# Altium schematic sheet FINGER_USB_HUB.SchDoc
size Letter; SheetNumber: 15; SheetTotal: 15
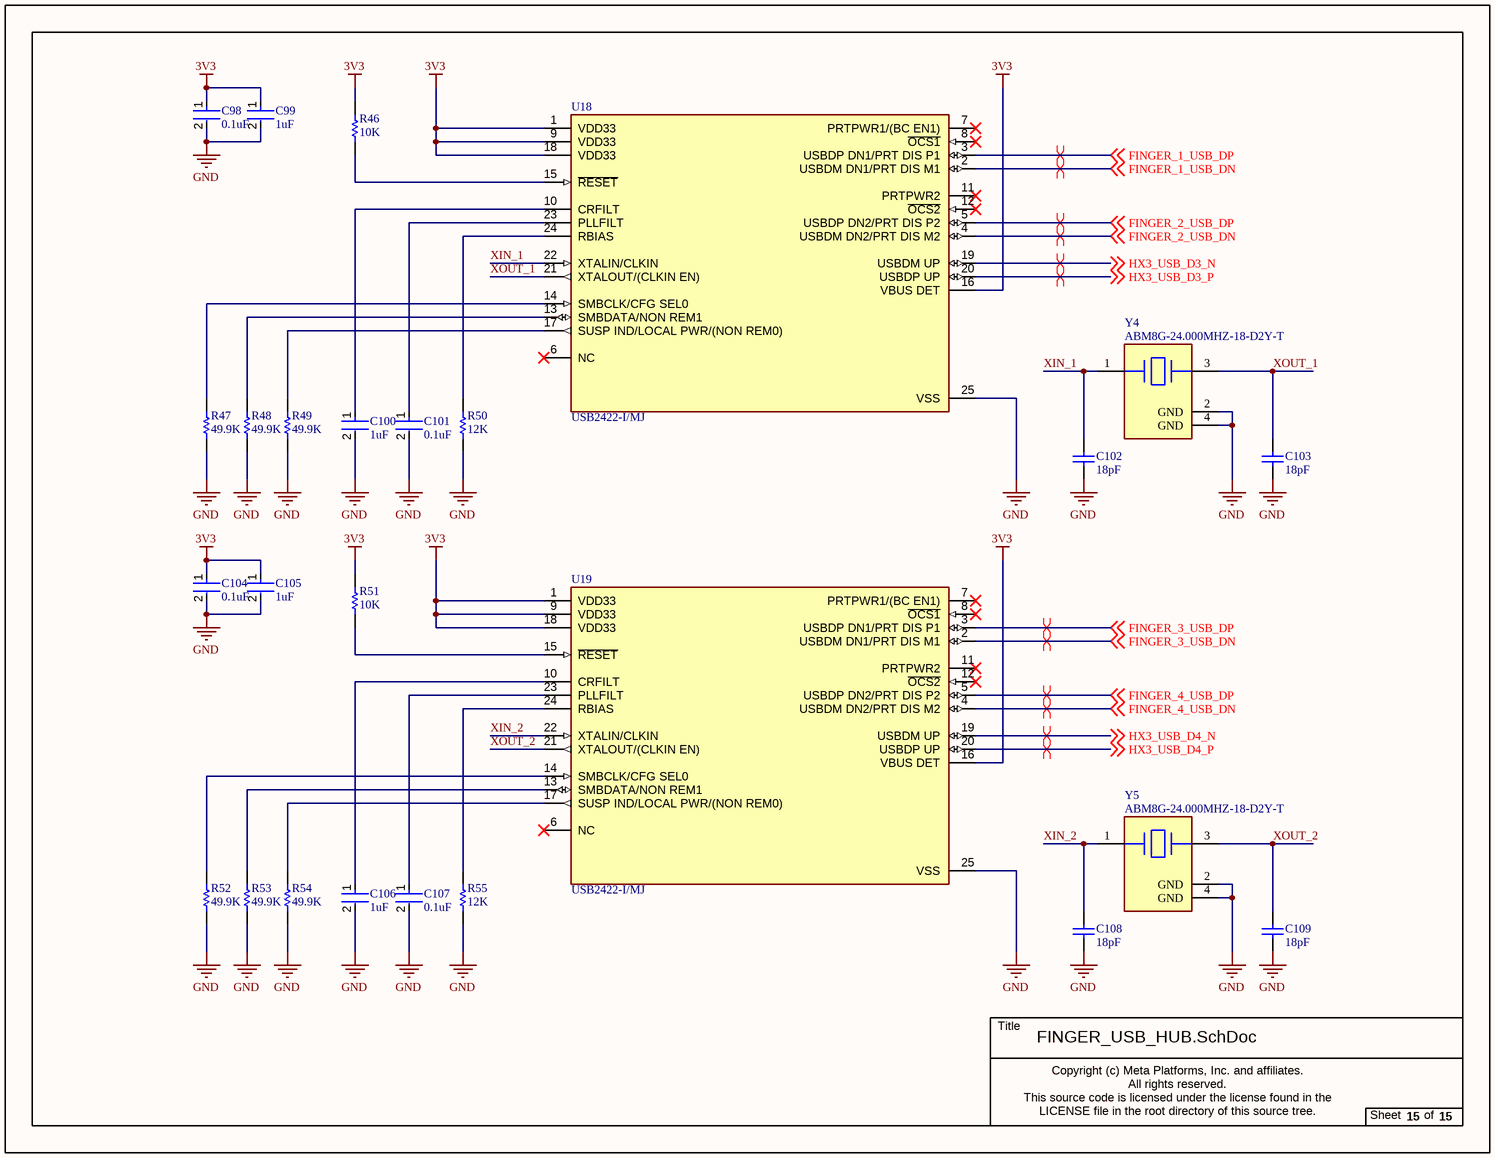
[diagram p0: FINGER_USB_HUB.SchDoc]

## Parts
C98  0.1uF  [FP-CC0201-BA-MFG]
C99  1uF  [FP-CL511-IPC_C]
C100  1uF  [FP-CL511-IPC_C]
C101  0.1uF  [FP-CC0201-BA-MFG]
C102  18pF  [CAPC1005X55X25NL05T10]
C103  18pF  [CAPC1005X55X25NL05T10]
C104  0.1uF  [FP-CC0201-BA-MFG]
C105  1uF  [FP-CL511-IPC_C]
C106  1uF  [FP-CL511-IPC_C]
C107  0.1uF  [FP-CC0201-BA-MFG]
C108  18pF  [CAPC1005X55X25NL05T10]
C109  18pF  [CAPC1005X55X25NL05T10]
R46  10K  [RESC1005X40X25ML05T10]
R47  49.9K  [RESC1005X40X25ML05T10]
R48  49.9K  [RESC1005X40X25ML05T10]
R49  49.9K  [RESC1005X40X25ML05T10]
R50  12K  [RESC1005X40X25ML05T05]
R51  10K  [RESC1005X40X25ML05T10]
R52  49.9K  [RESC1005X40X25ML05T10]
R53  49.9K  [RESC1005X40X25ML05T10]
R54  49.9K  [RESC1005X40X25ML05T10]
R55  12K  [RESC1005X40X25ML05T05]
U18  USB2422-I/MJ  [FP-24-S4QFN-4x4B-0_5P-MFG]
U19  USB2422-I/MJ  [FP-24-S4QFN-4x4B-0_5P-MFG]
Y4  ABM8G-24.000MHZ-18-D2Y-T  [FP-ABM8G-MFG]
Y5  ABM8G-24.000MHZ-18-D2Y-T  [FP-ABM8G-MFG]

## Nets
3V3: C98.1 C99.1 C104.1 C105.1 R46.2 R51.2 U18.1(VDD33) U18.9(VDD33) U18.16(VBUS_DET) U18.18(VDD33) U19.1(VDD33) U19.9(VDD33) U19.16(VBUS_DET) U19.18(VDD33)
GND: C98.2 C99.2 C100.2 C101.2 C102.1 C103.1 C104.2 C105.2 C106.2 C107.2 C108.1 C109.1 R47.1 R48.1 R49.1 R50.1 R52.1 R53.1 R54.1 R55.1 U18.25(VSS) U19.25(VSS) Y4.2(GND) Y4.4(GND) Y5.2(GND) Y5.4(GND)
FINGER_1_USB_DN: U18.2(USBDM_DN1/PRT_DIS_M1) ; off-sheet FINGER_1_USB_DN
FINGER_1_USB_DP: U18.3(USBDP_DN1/PRT_DIS_P1) ; off-sheet FINGER_1_USB_DP
FINGER_2_USB_DN: U18.4(USBDM_DN2/PRT_DIS_M2) ; off-sheet FINGER_2_USB_DN
FINGER_2_USB_DP: U18.5(USBDP_DN2/PRT_DIS_P2) ; off-sheet FINGER_2_USB_DP
FINGER_3_USB_DN: U19.2(USBDM_DN1/PRT_DIS_M1) ; off-sheet FINGER_3_USB_DN
FINGER_3_USB_DP: U19.3(USBDP_DN1/PRT_DIS_P1) ; off-sheet FINGER_3_USB_DP
FINGER_4_USB_DN: U19.4(USBDM_DN2/PRT_DIS_M2) ; off-sheet FINGER_4_USB_DN
FINGER_4_USB_DP: U19.5(USBDP_DN2/PRT_DIS_P2) ; off-sheet FINGER_4_USB_DP
HX3_USB_D3_N: U18.19(USBDM_UP) ; off-sheet HX3_USB_D3_N
HX3_USB_D3_P: U18.20(USBDP_UP) ; off-sheet HX3_USB_D3_P
HX3_USB_D4_N: U19.19(USBDM_UP) ; off-sheet HX3_USB_D4_N
HX3_USB_D4_P: U19.20(USBDP_UP) ; off-sheet HX3_USB_D4_P
XIN_1: C102.2 U18.22(XTALIN/CLKIN) Y4.1
XIN_2: C108.2 U19.22(XTALIN/CLKIN) Y5.1
XOUT_1: C103.2 U18.21(XTALOUT/(CLKIN_EN)) Y4.3
XOUT_2: C109.2 U19.21(XTALOUT/(CLKIN_EN)) Y5.3
NetC100_1: C100.1 U18.10(CRFILT)
NetC101_1: C101.1 U18.23(PLLFILT)
NetC106_1: C106.1 U19.10(CRFILT)
NetC107_1: C107.1 U19.23(PLLFILT)
NetR46_1: R46.1 U18.15(~{RESET})
NetR47_2: R47.2 U18.14(SMBCLK/CFG_SEL0)
NetR48_2: R48.2 U18.13(SMBDATA/NON_REM1)
NetR49_2: R49.2 U18.17(SUSP_IND/LOCAL_PWR/(NON_REM0))
NetR50_2: R50.2 U18.24(RBIAS)
NetR51_1: R51.1 U19.15(~{RESET})
NetR52_2: R52.2 U19.14(SMBCLK/CFG_SEL0)
NetR53_2: R53.2 U19.13(SMBDATA/NON_REM1)
NetR54_2: R54.2 U19.17(SUSP_IND/LOCAL_PWR/(NON_REM0))
NetR55_2: R55.2 U19.24(RBIAS)

Not connected (* = marked no-connect by the designer): U18 6(NC)* 7(PRTPWR1/(BC_EN1))* 8(~{OCS1})* 11(PRTPWR2)* 12(~{OCS2})*; U19 6(NC)* 7(PRTPWR1/(BC_EN1))* 8(~{OCS1})* 11(PRTPWR2)* 12(~{OCS2})*

## Layout directives
differential pair; differential pair class USB_2: FINGER_1_USB_DN, FINGER_1_USB_DP, FINGER_2_USB_DN, FINGER_2_USB_DP, FINGER_3_USB_DN, FINGER_3_USB_DP, FINGER_4_USB_DN, FINGER_4_USB_DP, HX3_USB_D3_N, HX3_USB_D3_P, HX3_USB_D4_N, HX3_USB_D4_P

## Notes on the sheet
- Title
- Copyright (c) Meta Platforms, Inc. and affiliates.
  All rights reserved.
  This source code is licensed under the license found in the
  LICENSE file in the root directory of this source tree.
- Sheet
- of

## Library data of the parts
C98 C101 C104 C107 = CMP-03422-000376-1: CAP CER 0.1UF 6.3V X5R 0201; Manufacturer: Yageo; Manufacturer Part Number: CC0201KRX5R5BB104; Tolerance: 0.1; Temperature Coefficient: 15%; Value: 100 nF; Material: Ceramic; Automotive: No; Device Class L2: Capacitors; Temperature Range High: +85°C; Capacitance: 100 nF; Temperature: -55°C to +85°C; ComponentLink2URL: http://www.yageo.com/documents/recent/UPY-GPHC_X5R_4V-to-50V_25.pdf; Category: Cap; Mouser Description: Multilayer Ceramic Capacitors MLCC - SMD/SMT 100nF 6.3V X5R 10%; Ipc Land Pattern Name: CAPC6030X30; Temperature Characteristic: X5R; Voltage Rating: 6.3 V; Lead Free: Yes; Digikey Description: CAP CER 0.1UF 6.3V X5R 0201; Device Class L1: Passive Components; Octopart: https://octopart.com/cc0201krx5r5bb104-yageo-9292636; Height: 0.33mm; Package: CC0201-BA; Footprint Url: http://www.yageo.com/exep/pages/download/literatures/UPY-C_GEN_24.pdf; ComponentLink2Description: Datasheet; Device Class L3: Ceramic Capacitors; Temperature Range Low: -55°C; RoHS: TRUE
C99 C100 C105 C106 = CMP-13271-001936-1: Cap Ceramic 1uF 10V X5R ±10% SMD 0402 +85°C Paper T/R; Depth: 0.5mm; Case Code (Imperial): 0402; Material: Ceramic; Mount: Surface Mount; Thickness: 0.022inch; Dielectric: X5R; Capacitance: 1uF; Radiation Hardening: No; Case/Package: 0402; Length: 1mm; Tolerance: 10%; Max Operating Temperature: 85°C; Package Quantity: 1; Width: 0.02inch; Voltage Rating: 10V; Contact Plating: Tin; Height: 0.5mm; Min Operating Temperature: -55°C; Case Code (Metric): 1005; Packaging: Tape and Reel
C102 C103 C108 C109 = CMP-2008-03918-1: Part Number: GRM1555C1H180JA01D; Manufacturer: Murata
R46 R51 = CMP-2002-03043-1: Part Number: CRCW040210K0FKEDHP; Manufacturer: Vishay Dale
R47-R49 R52-R54 = CMP-2002-07047-1: Manufacturer: Yageo / Phycomp; Part Number: RC0402FR-0749K9L
R50 R55 = CMP-2002-00646-4: Chip Resistor, 12 KOhm, +/- 1%, 0.1 W, -55 to 155 degC, 0402 (1005 Metric), RoHS, Tape and Reel; PartNumber: ERJ-2RKF1202X; Resistance: 12 KOhm; Voltage Rating: 50 V; Case\/Package: 0402; Power Rating: 100 mW; Length: 1 mm; PackageReference: 0402; DatasheetVersion: 04/2015; ComponentLink2Description: Datasheet; ComponentLink1URL: http://www.panasonic.com/; Pins: 2; Width: 0.5 mm; REACH SVHC: Yes; Packaging: Tape and Reel; Min Operating Temperature: -55 degC; Mounting Technology: Surface Mount; Max Operating Temperature: 155 degC; Case Code (Imperial): 0402; Height: 0.35 mm; Tolerance: 1%; PackageDescription: 2-Pin Surface Mount Device, Body 1 x 0.5 mm; RoHSCompliant: true; ComponentLink1Description: Manufacturer URL; Mount: Surface Mount; ComponentLink2URL: http://industrial.panasonic.com/cdbs/www-data/pdf/RDA0000/AOA0000C86.pdf; Package Quantity: 10000; Case Code (Metric): 1005
U18 U19 = CMP-06284-000010-1: IC HUB CTLR USB 2.0 24QFN; Manufacturer: Microchip; Min Supply Voltage: 3V; Standoff Height: 0mm; Usb Standard: USB 2.0; Interface: I2C,USB,SMBus; Number Of Ports: 2; Max Supply Voltage: 3.6V; Nominal Supply Current: 29-70mA; Device Class L1: Integrated Circuits (ICs); ComponentLink2URL: http://ww1.microchip.com/downloads/en/DeviceDoc/00001726B.pdf; Temperature: -40°C to +85°C; Lead Free: Yes; Category: IC; RoHS: TRUE; Digikey Description: IC HUB CTLR USB 2.0 24QFN; Device Class L2: Interface ICs; Height: 1mm; Device Class L3: USB Interface ICs; Temperature Range High: +85°C; Automotive: No; Ipc Land Pattern Name: QFN50P400X400X90-24; Temperature Range Low: -40°C; Manufacturer Part Number: USB2422-I/MJ; Mouser Description: Microchip USB2422-I/MJ; USB Controller; USB 2.0; 3 - 3.6 V; 24-Pin SQFN; Package: 24-S4QFN-4x4B-0.5P; Ambient Temperature Range Low: -40°C; ComponentLink2Description: Datasheet; Ambient Temperature Range High: +85°C; Octopart: https://octopart.com/usb2422-i%2Fmj-microchip-29030614
Y4 Y5 = CMP-27762-003871-2: Crystal 24MHz ±20ppm (Tol) ±30ppm (Stability) 18pF FUND 60Ω 4-Pin SMD T/R; ESR (Equivalent Series Resistance): 60R; Load Capacitance: 18pF; Height: 0.039inch; Operating Frequency: 24 MHz; Tolerance: 20ppm; Packaging: Tape and Reel; Case/Package: CSMD; Mount: Surface Mount; Number of Pins: 4; Length: 3.2mm; Series: ABM8G; Lead Free: Lead Free; Package Quantity: 1000; Series Resistance: 60R; Frequency Tolerance: 20ppm; Min Operating Temperature: -40°C; Termination: SMD/SMT; Radiation Hardening: No; Frequency: 24MHz; Frequency Stability: 30ppm; Depth: 2.5mm; Width: 0.098inch; Max Operating Temperature: 85°C